# EAGLE design main (EAGLE 7.1.0)
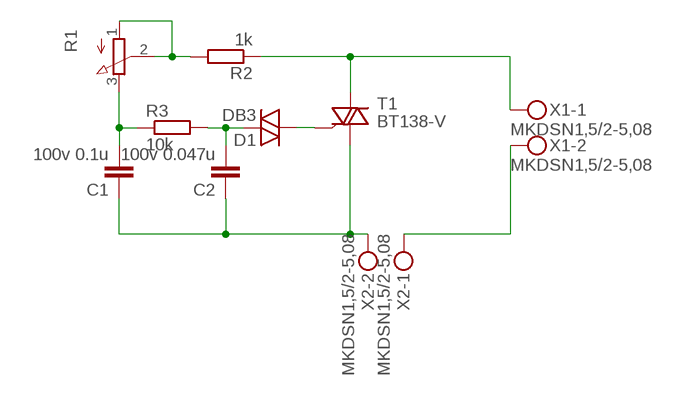
[diagram p0: schematic, sheet 1]

## Parts
C1  100v 0.1u  C-EU102-054X133  [C102-054X133]
C2  100v 0.047u  C-EU075-042X103  [C075-042X103]
D1  DB3  DIAC-GT32  [GT32]
R1  3RP/1610N  [3RP/1610N]
R2  1k  R-EU_0309/10  [0309/10]
R3  10k  R-EU_0309/10  [0309/10]
T1  BT138-V  [TO220BV]
X1  MKDSN1,5/2-5,08  [MKDSN1,5/2-5,08]
X2  MKDSN1,5/2-5,08  [MKDSN1,5/2-5,08]

## Nets
N$1: X1.2 X2.1
N$2: C1.1 C2.1 T1.T1(A1) X2.2
N$3: D1.1 T1.G
N$4: C1.2 R1.3(E) R3.1
N$5: R2.1 T1.T2(A2) X1.1
N$6: R1.1(A) R1.2(S) R2.2
N$7: C2.2 D1.2 R3.2

## Library data of the parts
C1 C2 = rcl:C-EU: CAPACITOR, European symbol
D1 = diode:DIAC-: DIAC
R1 = pot:3RP/1610N: 16mm Potentiometer one level Source: http://www.alphapotentiometers.net/html/16mm_pot_2.html
R2 R3 = rcl:R-EU_: RESISTOR, European symbol
T1 = triac:BT138: TRIAC Source: http://www.semiconductors.philips.com BT138_SERIES_2.pdf
X1 X2 = con-phoenix-508:MKDSN1,5/2-5,08: MKDSN 1,5/ 2-5,08 Printklemme Nennstrom: 13,5 A Nennspannung: 250 V Rastermaß: 5,08 mm Polzahl: 2 Anschlussart: Schraubanschluss Montage: Löten Anschlussrichtung Leiter/Platine: 0 ° Artikelnummer: 1729128 Source: http://eshop.phoenixcontact.com .. 1729128.pdf

## Board
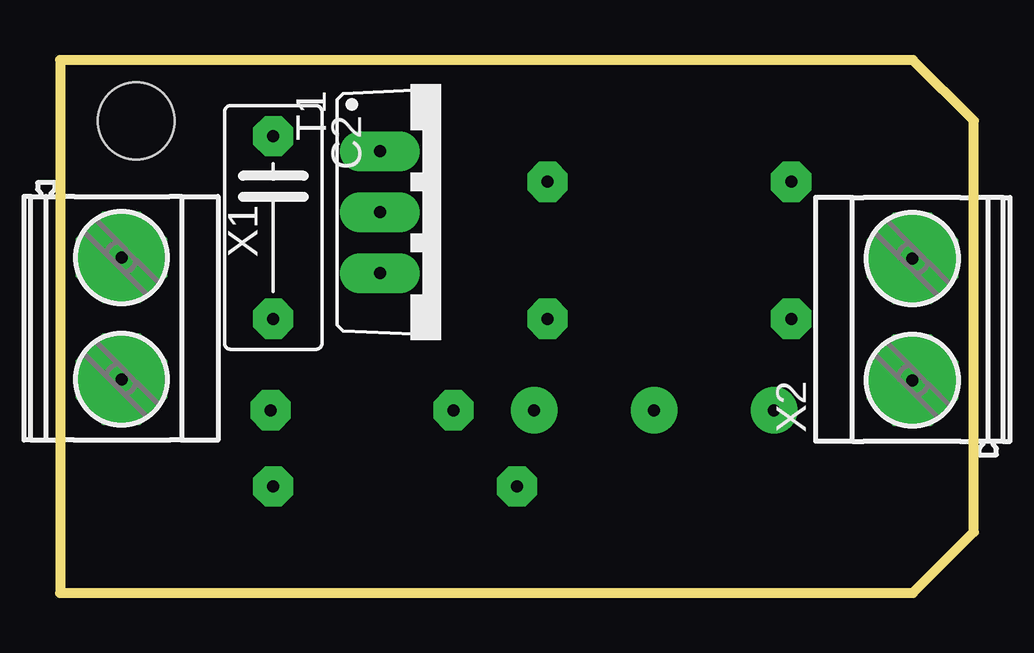
[diagram p1: board, top side]
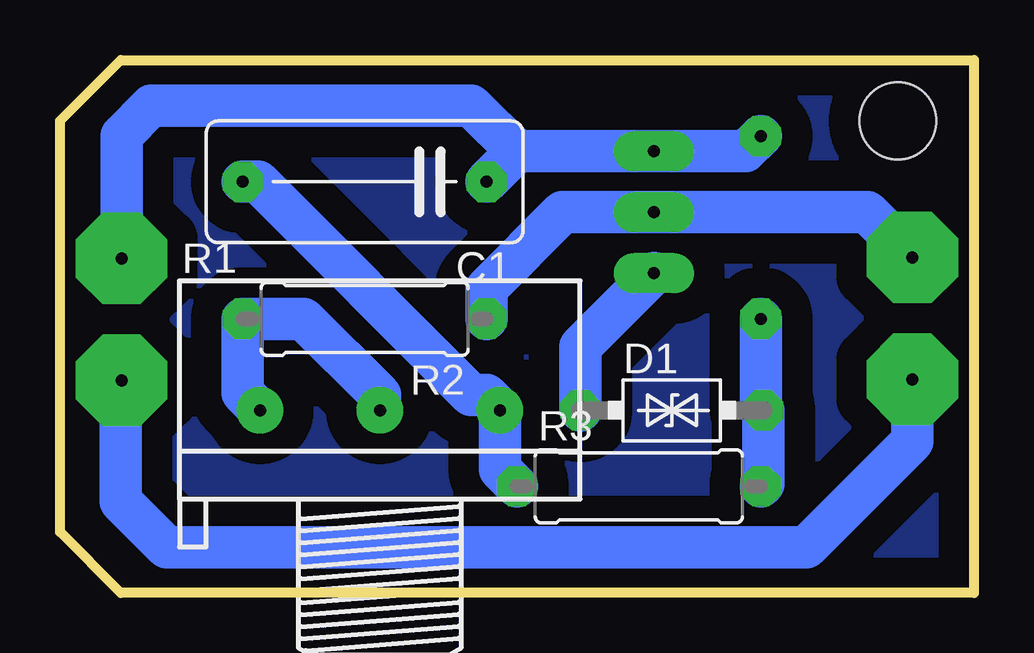
[diagram p2: board, bottom side, seen from below]

Size 38.1 x 22.22 mm. Coordinates in mm from the lower left corner, seen from the top.
Outline: 0,0 35.56,0 38.1,2.54 38.1,19.68 35.56,22.22 0,22.22 0,0
Copper layers (1*16): Top 0.035mm / dielectric 1.5mm / Bottom 0.035mm
Design rules "default": minimum track width 10mil, minimum drill 24mil, track to track 8mil, track to pad 8mil, pad to pad 8mil, via to via 8mil, smd to smd 8mil, copper to edge 40mil, drill to drill 8mil, minimum pad ring 10mil, minimum via ring 8mil, stop-mask expansion 4mil, vias tented up to drill 0mil, thermal gap 10mil
Holes 3.2 mm at 3.18,19.68

### Footprints (pad centres in the part's own frame; a part is rotated, then mirrored left to right if it is on the bottom)
C102-054X133 = drill 0.5 pad 1.676 octagon: 1 -5.08,0; 2 5.08,0
C075-042X103 = drill 0.5 pad 1.676 octagon: 1 -3.81,0; 2 3.81,0
GT32 = drill 0.5 pad 1.676 octagon: 1 -3.81,0; 2 3.81,0
3RP/1610N = drill 0.5 pad 1.93: 1 -5,0; 2 0,0; 3 5,0
0309/10 = drill 0.5 pad 1.676 octagon: 1 -5.08,0; 2 5.08,0
TO220BV = drill 0.5 pad 1.676 long: G 2.54,-2.54; T1 -2.54,-2.54; T2 0,-2.54
MKDSN1,5/2-5,08 = drill 0.5 pad 3.81 octagon: 1 -2.561,0.025; 2 2.519,0.025

### Placement (x,y rotation side)
C1  25.4,17.14 180 bottom
C2  8.89,15.24 270 top
D1  12.59,7.62 0 bottom
R1  24.77,7.62 0 bottom
R2  25.4,11.43 180 bottom
R3  13.97,4.45 0 bottom
T1  15.88,15.88 270 top
X1  2.54,11.43 270 top
X2  35.56,11.43 90 top

### Tracks (layer width: path | path; a pad name or v marks a point on that pad's centre or on a via)
N$1
  Bottom 1.778: X1.2 2.56,6.33 6.99,1.91 33.65,1.91 35.56,3.81 35.56,8.84 X2.1
N$2
  Bottom 1.778: 35.56,13.97 X2.2 35.53,19.07 34.29,20.32 20.96,20.32 19.05,18.41 | 19.05,18.41 T1.T1 9.53,18.41 C2.1 | 19.05,18.41 C1.1
N$3
  Bottom 1.778: D1.1 16.4,10.27 T1.G
N$4
  Bottom 1.778: R3.1 19.77,5.16 R1.3 19.77,7.7 20.32,8.26 20.96,8.26 29.84,17.14 C1.2
N$5
  Bottom 1.778: X1.1 4.45,15.88 T1.T2 17.14,15.88 20.32,12.7 R2.1
N$6
  Bottom 1.778: R1.2 24.77,8.26 27.94,11.43 R2.2 30.48,8.34 R1.1
N$7
  Bottom 1.778: C2.2 8.89,7.73 D1.2 8.78,4.55 R3.2
N$8
  pour Bottom (isolate 1.27): 0,0 0,22.22 35.56,22.22 38.1,19.68 38.1,2.54 35.56,0